# Altium project PE2_RC_Controller.PrjPcb
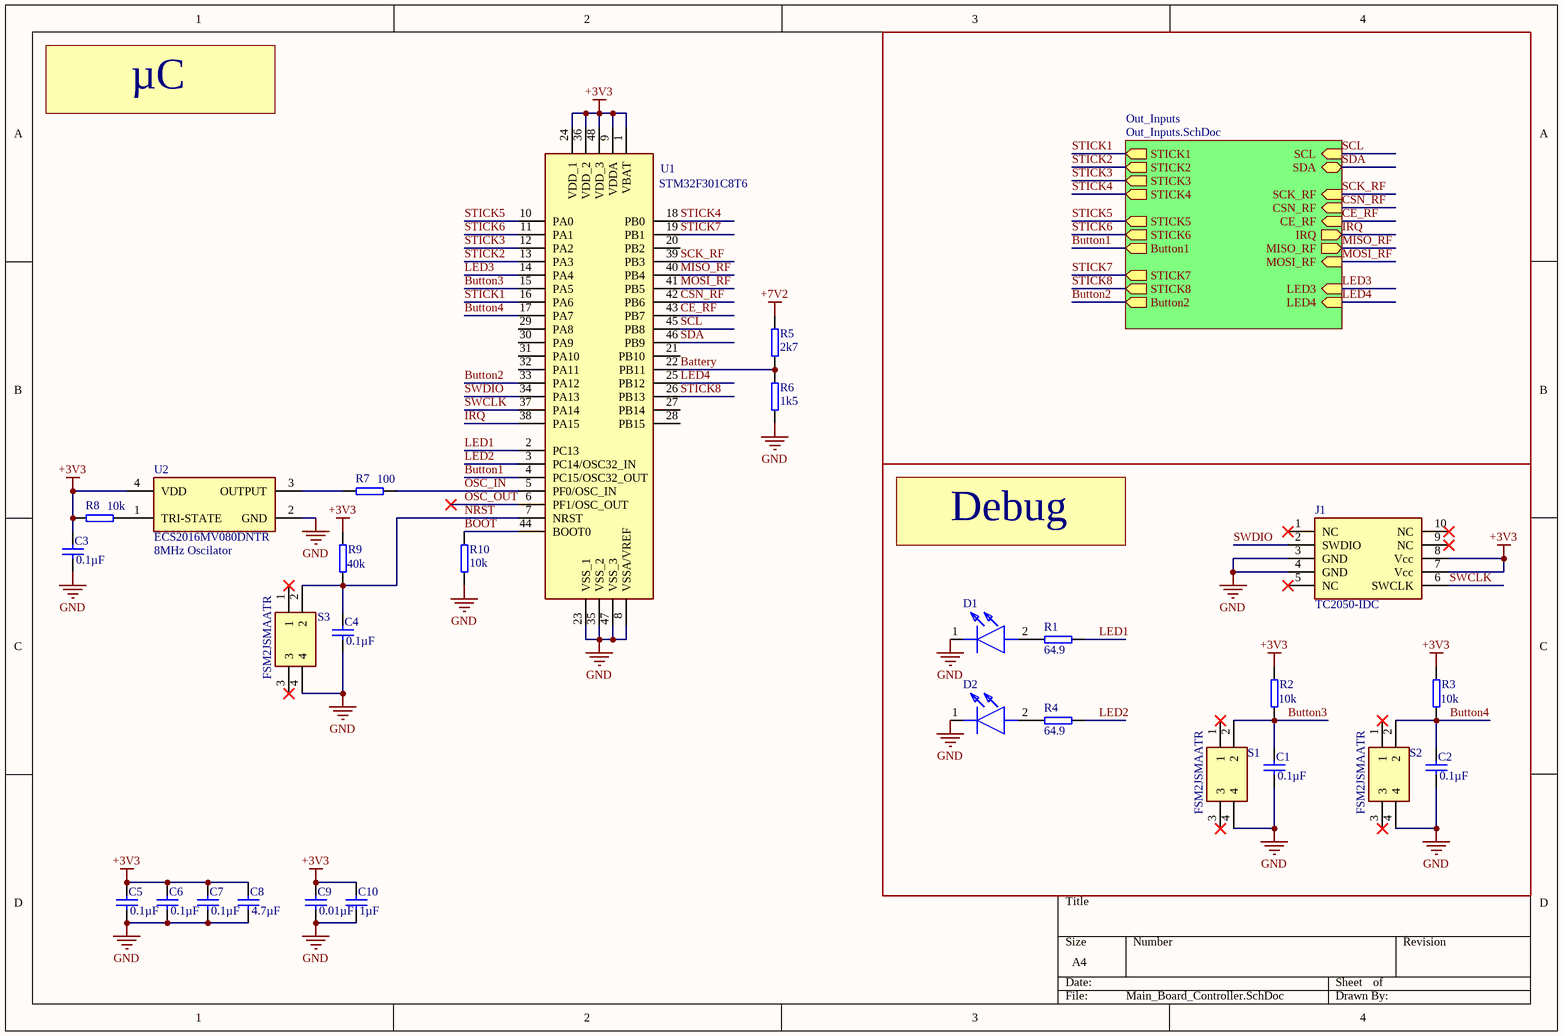
[diagram p0: Main_Board_Controller.SchDoc]
2 sheets, 59 parts. Net scope: hierarchical (ports join the sheet entries above them; power ports are global).
Board file: Controller_PCB.PcbDoc
Sheets:
  Main_Board_Controller.SchDoc
    Out_Inputs = Out_Inputs.SchDoc

## Sheet Main_Board_Controller.SchDoc
size A4; SheetNumber: 1; SheetTotal: 2

### Parts
C1  0.1µF  [Capacitor 0603]
C2  0.1µF  [Capacitor 0603]
C3  0.1µF  [Capacitor 0603]
C4  0.1µF  [Capacitor 0603]
C5  0.1µF  [Capacitor 0603]
C6  0.1µF  [Capacitor 0603]
C7  0.1µF  [Capacitor 0603]
C8  4.7µF  [Capacitor 0603]
C9  0.01µF  [Capacitor 0603]
C10  1µF  [Capacitor 0603]
D1  LED 1608 (0603) SMD  [INS21AT2G]  (value not drawn)
D2  LED 1608 (0603) SMD  [INS21AT2G]  (value not drawn)
J1  TC2050-IDC  [TAG-CONNECT_TC2050-IDC]
R1  64.9  [Resistor 0603]
R2  10k  [Resistor 0603]
R3  10k  [Resistor 0603]
R4  64.9  [Resistor 0603]
R5  2k7  [Resistor 0603]
R6  1k5  [Resistor 0603]
R7  100  [Resistor 0603]
R8  10k  [Resistor 0603]
R9  40k  [Resistor 0603]
R10  10k  [Resistor 0603]
S1  FSM2JSMAATR  [FSM2J_1]
S2  FSM2JSMAATR  [FSM2J_1]
S3  FSM2JSMAATR  [FSM2J_1]
U1  STM32F301C8T6  [QFP50P900X900X160-48N]
U2  ECS2016MV080DNTR  [OSC_ECS-1618-300-BN-TR]

### Sub-sheets
Out_Inputs = Out_Inputs.SchDoc: STICK1 (out), STICK2 (out), STICK3 (out), STICK4 (out), SCL (in), SDA (bidir), SCK_RF (in), CSN_RF (in), CE_RF (in), IRQ (out), MISO_RF (out), MOSI_RF (in), LED3 (in), LED4 (in), STICK5 (out), STICK6 (out), STICK7 (out), STICK8 (out), Button2 (out), Button1 (out)

### Nets
+3V3: C3.1 C5.1 C6.1 C7.1 C8.1 C9.1 C10.1 J1.7(Vcc) J1.8(Vcc) R2.1 R3.1 R8.2 R9.1 U1.1(VBAT) U1.9(VDDA) U1.24(VDD_1) U1.36(VDD_2) U1.48(VDD_3) U2.4(VDD)
+7V2: R5.2
GND: C1.2 C2.2 C3.2 C4.2 C5.2 C6.2 C7.2 C8.2 C9.2 C10.2 D1.1(K) D2.1(K) J1.3(GND) J1.4(GND) R6.1 R10.1 S1.4 S2.4 S3.4 U1.8(VSSA/VREF) U1.23(VSS_1) U1.35(VSS_2) U1.47(VSS_3) U2.2(GND)
Battery: R5.1 R6.2 U1.22(PB11)
BOOT: R10.2 U1.44(BOOT0)
Button1: U1.4(PC15/OSC32_OUT) ; sheet Out_Inputs/Button1
Button2: U1.33(PA12) ; sheet Out_Inputs/Button2
Button3: C1.1 R2.2 S1.2 U1.15(PA5)
Button4: C2.1 R3.2 S2.2 U1.17(PA7)
CE_RF: U1.43(PB7) ; sheet Out_Inputs/CE_RF
CSN_RF: U1.42(PB6) ; sheet Out_Inputs/CSN_RF
IRQ: U1.38(PA15) ; sheet Out_Inputs/IRQ
LED1: R1.1 U1.2(PC13)
LED2: R4.1 U1.3(PC14/OSC32_IN)
LED3: U1.14(PA4) ; sheet Out_Inputs/LED3
LED4: U1.25(PB12) ; sheet Out_Inputs/LED4
MISO_RF: U1.40(PB4) ; sheet Out_Inputs/MISO_RF
MOSI_RF: U1.41(PB5) ; sheet Out_Inputs/MOSI_RF
NRST: C4.1 R9.2 S3.2 U1.7(NRST)
OSC_IN: R7.1 U1.5(PF0/OSC_IN)
OSC_OUT: U1.6(PF1/OSC_OUT)
SCK_RF: U1.39(PB3) ; sheet Out_Inputs/SCK_RF
SCL: U1.45(PB8) ; sheet Out_Inputs/SCL
SDA: U1.46(PB9) ; sheet Out_Inputs/SDA
STICK1: U1.16(PA6) ; sheet Out_Inputs/STICK1
STICK2: U1.13(PA3) ; sheet Out_Inputs/STICK2
STICK3: U1.12(PA2) ; sheet Out_Inputs/STICK3
STICK4: U1.18(PB0) ; sheet Out_Inputs/STICK4
STICK5: U1.10(PA0) ; sheet Out_Inputs/STICK5
STICK6: U1.11(PA1) ; sheet Out_Inputs/STICK6
STICK7: U1.19(PB1) ; sheet Out_Inputs/STICK7
STICK8: U1.26(PB13) ; sheet Out_Inputs/STICK8
SWCLK: J1.6(SWCLK) U1.37(PA14)
SWDIO: J1.2(SWDIO) U1.34(PA13)
NetD1_2: D1.2(A) R1.2
NetD2_2: D2.2(A) R4.2
NetR7_2: R7.2 U2.3(OUTPUT)
NetR8_1: R8.1 U2.1(TRI-STATE)

Not connected (* = marked no-connect by the designer): J1 1(NC)* 5(NC)* 9(NC)* 10(NC)*; S1 1* 3*; S2 1* 3*; S3 1* 3*; U1 20(PB2) 21(PB10) 27(PB14) 28(PB15) 29(PA8) 30(PA9) 31(PA10) 32(PA11)

### Notes on the sheet
- µC
- (near U2) 8MHz Oscilator
- Debug

### Library data of the parts
C1-C10 = Capacitor 0603: Capacitor
J1 = TC2050-IDC: CBL PLUG-OF-NAILS 10-PIN W/LEGS; MF: Tag-Connect LLC; Package: None; Digi-Key_Part_Number: TC2050-IDC-ND; Value: *; MP: TC2050-IDC; SnapEDA_Link: https://www.snapeda.com/parts/TC2050-IDC/Tag-Connect%20LLC/view-part/134529/?ref=snap; Digi-Key_Purchase_URL: https://www.digikey.com/product-detail/en/tag-connect-llc/TC2050-IDC/TC2050-IDC-ND/2605366?utm_source=snapeda&utm_medium=aggregator&utm_campaign=symbol
R1-R10 = Resistor 0603: Resistor
S1-S3 = FSM2JSMAATR: Switch; Manufacturer_Name: TE Connectivity; Datasheet Link: http://www.te.com/commerce/DocumentDelivery/DDEController?Action=showdoc&DocId=Customer+Drawing%7F2-1437565-7%7FV%7Fpdf%7FEnglish%7FENG_CD_2-1437565-7_V.pdf%7F2-1437565-9; Manufacturer_Part_Number: FSM2JSMAATR; Mouser Part Number: 506-FSM2JSMAATR; Mouser Price/Stock: https://www.mouser.co.uk/ProductDetail/TE-Connectivity-Alcoswitch/FSM2JSMAATR?qs=g%252BEszo6zu8MKdISiZRITCQ%3D%3D; Arrow Part Number: FSM2JSMAATR; Arrow Price/Stock: https://www.arrow.com/en/products/fsm2jsmaatr/te-connectivity?region=nac
U1 = STM32F301C8T6: STMICROELECTRONICS - STM32F301C8T6 - MCU, 32BIT, CORTEX-M4, 72MHZ, LQFP-48; Geometry.Height: 1.6mm; Mouser Part Number: 511-STM32F301C8T6; Mouser Price/Stock: https://www.mouser.co.uk/ProductDetail/STMicroelectronics/STM32F301C8T6?qs=DqCdCwOw4%2F52bYCbIDWtEg%3D%3D; Manufacturer_Name: STMicroelectronics; Manufacturer_Part_Number: STM32F301C8T6; Datasheet Link: https://www.st.com/resource/en/datasheet/stm32f301c8.pdf
U2 = ECS-2016MV-250-CN-TR3: 25 MHz XO (Standard) HCMOS Oscillator 1.8V ~ 3.3V Enable/Disable 4-SMD, No Lead; MF: ECS Inc.; SnapEDA_Link: https://www.snapeda.com/parts/ECS-2016MV-250-CN-TR3/ECS+Inc./view-part/?ref=snap; Value: *; Purchase-URL: https://pricing.snapeda.com/search/part/ECS-2016MV-250-CN-TR3/?ref=eda; Check_prices: https://www.snapeda.com/parts/ECS-2016MV-250-CN-TR3/ECS+Inc./view-part/?ref=eda; Availability: In Stock; Price: None; MP: ECS-2016MV-250-CN-TR3; Package: None

## Sheet Out_Inputs.SchDoc
size A4; SheetNumber: 2; SheetTotal: 2
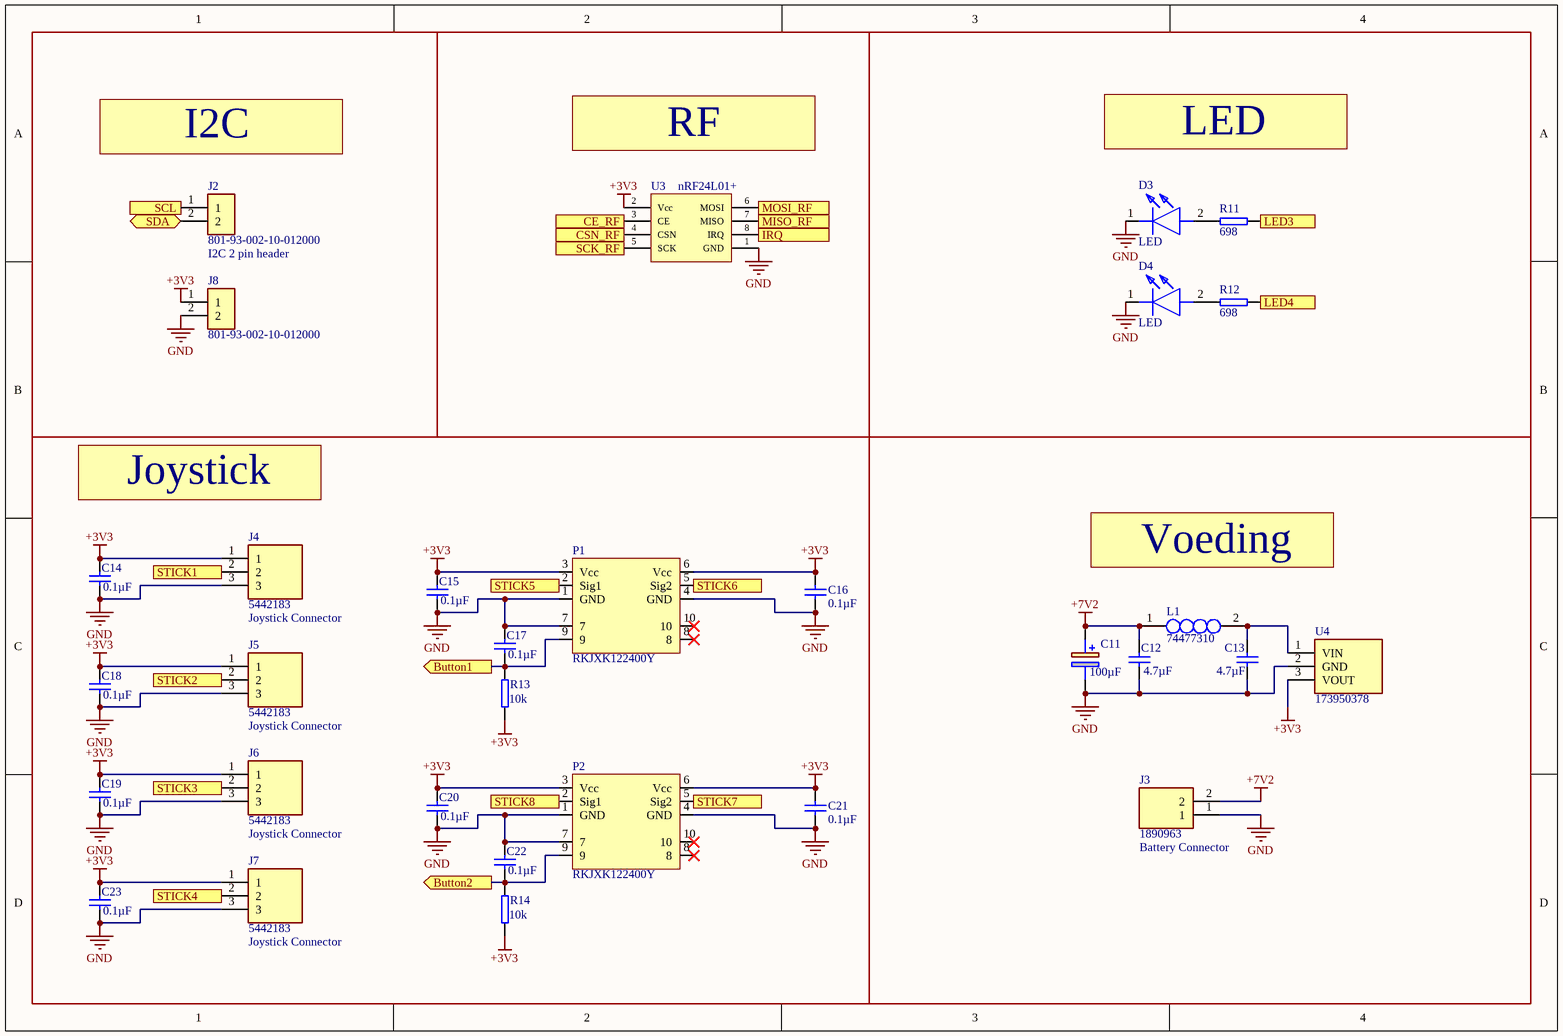
[diagram p1: Out_Inputs.SchDoc]

### Parts
C11  100µF  [CAPPRD350W52D800H1300]
C12  4.7µF  [Capacitor 1206]
C13  4.7µF  [Capacitor 1206]
C14  0.1µF  [Capacitor 0603]
C15  0.1µF  [Capacitor 0603]
C16  0.1µF  [Capacitor 0603]
C17  0.1µF  [Capacitor 0603]
C18  0.1µF  [Capacitor 0603]
C19  0.1µF  [Capacitor 0603]
C20  0.1µF  [Capacitor 0603]
C21  0.1µF  [Capacitor 0603]
C22  0.1µF  [Capacitor 0603]
C23  0.1µF  [Capacitor 0603]
D3  LED  [HLMP-4740]
D4  LED  [HLMP-4740]
J2  801-93-002-10-012000  [801-93-002-10-012000]
J3  1890963  [1890963]
J4  5442183  [5442183]
J5  5442183  [5442183]
J6  5442183  [5442183]
J7  5442183  [5442183]
J8  801-93-002-10-012000  [801-93-002-10-012000]
L1  74477310  [WE-PD2_453255]
P1  RKJXK122400Y  [RKJXK122400Y]
P2  RKJXK122400Y  [RKJXK122400Y]
R11  698  [Resistor 0603]
R12  698  [Resistor 0603]
R13  10k  [Resistor 0603]
R14  10k  [Resistor 0603]
U3  nRF24L01+  [nRF24L01+]
U4  173950378  [173950378]

### Blocks framed on the sheet
Joystick: C14-C23 J4-J7 P1 P2 R13 R14

### Ports
Button1 (out, see Main_Board_Controller[3A]), Button2 (out, see Main_Board_Controller[3B]), CE_RF (in, see Main_Board_Controller[4A]), CSN_RF (in, see Main_Board_Controller[4A]), IRQ (out, see Main_Board_Controller[4A]), LED3 (in, see Main_Board_Controller[4B]), LED4 (in, see Main_Board_Controller[4B]), MISO_RF (out, see Main_Board_Controller[4A]), MOSI_RF (in, see Main_Board_Controller[4B]), SCK_RF (in, see Main_Board_Controller[4A]), SCL (in, see Main_Board_Controller[4A]), SDA (bidir, see Main_Board_Controller[4A]), STICK1 (out, see Main_Board_Controller[3A]), STICK2 (out, see Main_Board_Controller[3A]), STICK3 (out, see Main_Board_Controller[3A]), STICK4 (out, see Main_Board_Controller[3A]), STICK5 (out, see Main_Board_Controller[3A]), STICK6 (out, see Main_Board_Controller[3A]), STICK7 (out, see Main_Board_Controller[3B]), STICK8 (out, see Main_Board_Controller[3B])

### Nets
+3V3: C14.1 C15.1 C16.1 C18.1 C19.1 C20.1 C21.1 C23.1 J4.1 J5.1 J6.1 J7.1 J8.1 P1.3(Vcc) P1.6(Vcc) P2.3(Vcc) P2.6(Vcc) R13.2 R14.2 U3.2(Vcc) U4.3(VOUT)
+7V2: C11.1(+) C12.1 J3.2 L1.1
GND: C11.2(-) C12.2 C13.2 C14.2 C15.2 C16.2 C17.1 C18.2 C19.2 C20.2 C21.2 C22.1 C23.2 D3.1(K) D4.1(K) J3.1 J4.3 J5.3 J6.3 J7.3 J8.2 P1.1(GND) P1.4(GND) P1.7 P2.1(GND) P2.4(GND) P2.7 U3.1(GND) U4.2(GND)
Button1: C17.2 P1.9 R13.1 ; port Button1
Button2: C22.2 P2.9 R14.1 ; port Button2
CE_RF: U3.3(CE) ; port CE_RF
CSN_RF: U3.4(CSN) ; port CSN_RF
IRQ: U3.8(IRQ) ; port IRQ
LED3: R11.1 ; port LED3
LED4: R12.1 ; port LED4
MISO_RF: U3.7(MISO) ; port MISO_RF
MOSI_RF: U3.6(MOSI) ; port MOSI_RF
SCK_RF: U3.5(SCK) ; port SCK_RF
SCL: J2.1 ; port SCL
SDA: J2.2 ; port SDA
STICK1: J4.2 ; port STICK1
STICK2: J5.2 ; port STICK2
STICK3: J6.2 ; port STICK3
STICK4: J7.2 ; port STICK4
STICK5: P1.2(Sig1) ; port STICK5
STICK6: P1.5(Sig2) ; port STICK6
STICK7: P2.5(Sig2) ; port STICK7
STICK8: P2.2(Sig1) ; port STICK8
NetC13_1: C13.1 L1.2 U4.1(VIN)
NetD3_2: D3.2(A) R11.2
NetD4_2: D4.2(A) R12.2

Not connected (* = marked no-connect by the designer): P1 8* 10*; P2 8* 10*

### Notes on the sheet
- I2C
- RF
- LED
- I2C 2 pin header
- Voeding
- Joystick Connector
- (near J3) Battery Connector
- (near J7) Joystick Connector

### Library data of the parts
C11 = 860010674014: Wurth Elektronik 100uF 50 V dc Aluminium Electrolytic Capacitor; Manufacturer_Part_Number: 865080543009; Geometry.Height: 5.5mm; Mouser Part Number: 710-865080543009; Mouser Price/Stock: https://www.mouser.co.uk/ProductDetail/Wurth-Elektronik/865080543009?qs=0KOYDY2FL2%2F%252BYmhMLtEhDQ%3D%3D; Manufacturer_Name: Wurth Elektronik; Datasheet Link: https://katalog.we-online.de/pbs/datasheet/865080543009.pdf; Mouser: 710-860010674014
C12 C13 = Capacitor 1206: Capacitor; Mouser: 710-885012208094
C14-C23 = Capacitor 0603: Capacitor
J2 J8 = 801-93-002-10-012000: 2 pin header 2.54mm pitch; Mouser: 575-8019300210012000
J3 = 1890963: Connector: 2pin screw terminal; Manufacturer_Name: Phoenix Contact; Datasheet Link: http://www.phoenixcontact.com/de/produkte/1890963/pdf; Height: 15.15mm; Manufacturer_Part_Number: 1890963; Mouser Part Number: 651-1890963; Mouser Price/Stock: https://www.mouser.co.uk/ProductDetail/Phoenix-Contact/1890963?qs=5W%252BNKB25SvKX6KIA0xFJOA%3D%3D; Arrow Part Number: 1890963; Arrow Price/Stock: https://www.arrow.com/en/products/1890963/phoenix-contact?region=nac
J4-J7 = 5442183: Connector; Manufacturer_Name: Phoenix Contact; Datasheet Link: http://www.phoenixcontact.net/product/5442183; Height: 10.12mm; Manufacturer_Part_Number: 5442183; Mouser Part Number: 651-5442183; Mouser Price/Stock: https://www.mouser.co.uk/ProductDetail/Phoenix-Contact/5442183?qs=9Y9qB%2FCsC3nrqTUHTUeJoQ%3D%3D; Arrow Part Number: 5442183; Arrow Price/Stock: https://www.arrow.com/en/products/5442183/phoenix-contact?region=nac
L1 = 7447730: Inductor; Manufacturer_Name: Wurth Elektronik; Manufacturer_Part_Number: 7447730; Mouser Part Number: 710-7447730; Mouser Price/Stock: https://www.mouser.co.uk/ProductDetail/Wurth-Elektronik/7447730?qs=rS3zZhy2AQMpnsrOMerOTw%3D%3D; Mouser: 710-74477310
R11-R14 = Resistor 0603: Resistor
U4 = 173950378: MagI3C Power Module 0.5A 3.3V 6-28V SIP3; Manufacturer_Name: Wurth Elektronik; Geometry.Height: 11mm; Mouser Part Number: 710-173950378; Mouser Price/Stock: https://www.mouser.co.uk/ProductDetail/Wurth-Elektronik/173950378?qs=SElPoaY2y5Iv2HEnICmd%252BA%3D%3D; Manufacturer_Part_Number: 173950378; Datasheet Link: http://katalog.we-online.de/pm/datasheet/173950378.pdf

## Nets that join several sheets
+3V3: Main_Board_Controller (19 pins), Out_Inputs (21 pins)
+7V2: Main_Board_Controller (R5.2), Out_Inputs (C11.1 C12.1 J3.2 L1.1)
GND: Main_Board_Controller (24 pins), Out_Inputs (29 pins)
Button1: Main_Board_Controller (U1.4), Out_Inputs (C17.2 P1.9 R13.1)
Button2: Main_Board_Controller (U1.33), Out_Inputs (C22.2 P2.9 R14.1)
CE_RF: Main_Board_Controller (U1.43), Out_Inputs (U3.3)
CSN_RF: Main_Board_Controller (U1.42), Out_Inputs (U3.4)
IRQ: Main_Board_Controller (U1.38), Out_Inputs (U3.8)
LED3: Main_Board_Controller (U1.14), Out_Inputs (R11.1)
LED4: Main_Board_Controller (U1.25), Out_Inputs (R12.1)
MISO_RF: Main_Board_Controller (U1.40), Out_Inputs (U3.7)
MOSI_RF: Main_Board_Controller (U1.41), Out_Inputs (U3.6)
SCK_RF: Main_Board_Controller (U1.39), Out_Inputs (U3.5)
SCL: Main_Board_Controller (U1.45), Out_Inputs (J2.1)
SDA: Main_Board_Controller (U1.46), Out_Inputs (J2.2)
STICK1: Main_Board_Controller (U1.16), Out_Inputs (J4.2)
STICK2: Main_Board_Controller (U1.13), Out_Inputs (J5.2)
STICK3: Main_Board_Controller (U1.12), Out_Inputs (J6.2)
STICK4: Main_Board_Controller (U1.18), Out_Inputs (J7.2)
STICK5: Main_Board_Controller (U1.10), Out_Inputs (P1.2)
STICK6: Main_Board_Controller (U1.11), Out_Inputs (P1.5)
STICK7: Main_Board_Controller (U1.19), Out_Inputs (P2.5)
STICK8: Main_Board_Controller (U1.26), Out_Inputs (P2.2)